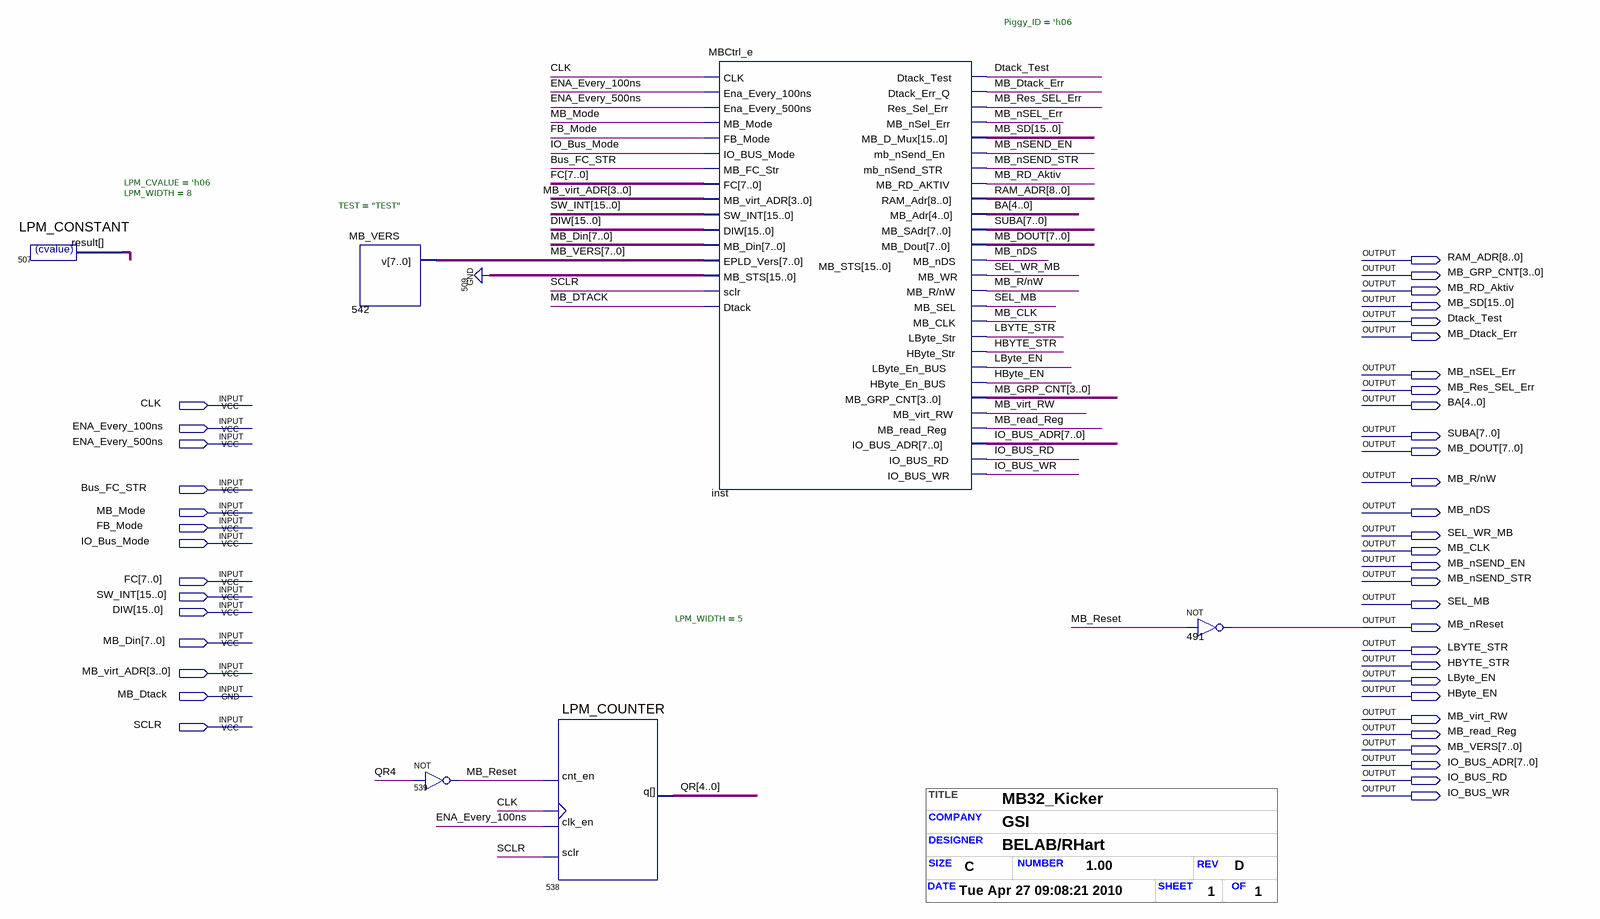
[diagram p0: schematic sheet]
// Quartus schematic mb32k.bdf as structural Verilog: 6 symbols, 43 pins
// Title block: TITLE: MB32_Kicker; COMPANY: GSI; DESIGNER: BELAB/RHart; SIZE: C; NUMBER: 1.00; REV: D; DATE: Tue Apr 27 09:08:21 2010; SHEET: 1; OF: 1
module mb32k (
  input  CLK,
  input  ENA_Every_100ns,
  input  ENA_Every_500ns,
  input  Bus_FC_STR,
  input  MB_Mode,
  input  FB_Mode,
  input  IO_Bus_Mode,
  input  [7:0] FC,
  input  [15:0] SW_INT,
  input  [15:0] DIW,
  input  [7:0] MB_Din,
  input  [3:0] MB_virt_ADR,
  input  MB_Dtack,
  input  SCLR,
  output [8:0] RAM_ADR,
  output [3:0] MB_GRP_CNT,
  output MB_RD_Aktiv,
  output [15:0] MB_SD,
  output Dtack_Test,
  output MB_Dtack_Err,
  output MB_nSEL_Err,
  output MB_Res_SEL_Err,
  output [4:0] BA,
  output [7:0] SUBA,
  output [7:0] MB_DOUT,
  output \MB_R/nW ,
  output MB_nDS,
  output SEL_WR_MB,
  output MB_CLK,
  output MB_nSEND_EN,
  output MB_nSEND_STR,
  output SEL_MB,
  output MB_nReset,
  output LBYTE_STR,
  output HBYTE_STR,
  output LByte_EN,
  output HByte_EN,
  output MB_virt_RW,
  output MB_read_Reg,
  output [7:0] MB_VERS,
  output [7:0] IO_BUS_ADR,
  output IO_BUS_RD,
  output IO_BUS_WR
);

  wire MB_Reset;
  wire [4:0] QR;
  wire [7:0] n507_result;

  LPM_CONSTANT #(.LPM_CVALUE('h06), .LPM_WIDTH(8)) u_507 (.result(n507_result));
  MB_VERS #(.TEST("TEST")) u_542 (.v(MB_VERS));
  not u_539 (MB_Reset, QR[4]);
  LPM_COUNTER #(.LPM_WIDTH(5)) u_538 (.cnt_en(MB_Reset), .clock(CLK), .clk_en(ENA_Every_100ns), .sclr(SCLR), .q(QR));
  MBCtrl_e #(.Piggy_ID('h06)) inst (
    .CLK(CLK), .Ena_Every_100ns(ENA_Every_100ns), .Ena_Every_500ns(ENA_Every_500ns), .MB_Mode(MB_Mode),
    .FB_Mode(FB_Mode), .IO_BUS_Mode(IO_Bus_Mode), .MB_FC_Str(Bus_FC_STR), .FC(FC), .MB_virt_ADR(MB_virt_ADR),
    .SW_INT(SW_INT), .DIW(DIW), .MB_Din(MB_Din), .EPLD_Vers(MB_VERS), .MB_STS({16{1'b0}}), .sclr(SCLR),
    .Dtack(MB_Dtack), .Dtack_Test(Dtack_Test), .Dtack_Err_Q(MB_Dtack_Err), .Res_Sel_Err(MB_Res_SEL_Err),
    .MB_nSel_Err(MB_nSEL_Err), .MB_D_Mux(MB_SD), .mb_nSend_En(MB_nSEND_EN), .mb_nSend_STR(MB_nSEND_STR),
    .MB_RD_AKTIV(MB_RD_Aktiv), .RAM_Adr(RAM_ADR), .MB_Adr(BA), .MB_SAdr(SUBA), .MB_Dout(MB_DOUT),
    .MB_nDS(MB_nDS), .MB_WR(SEL_WR_MB), .\MB_R/nW (\MB_R/nW ), .MB_SEL(SEL_MB), .MB_CLK(MB_CLK),
    .LByte_Str(LBYTE_STR), .HByte_Str(HBYTE_STR), .LByte_En_BUS(LByte_EN), .HByte_En_BUS(HByte_EN),
    .MB_GRP_CNT(MB_GRP_CNT), .MB_virt_RW(MB_virt_RW), .MB_read_Reg(MB_read_Reg), .IO_BUS_ADR(IO_BUS_ADR),
    .IO_BUS_RD(IO_BUS_RD), .IO_BUS_WR(IO_BUS_WR));
  not u_491 (MB_nReset, MB_Reset);
endmodule
